# Altium schematic sheet Main_sch.SchDoc: Li-ion Battery Charger
size A4; Engineer: Kavindu Makaranda; Revision: 1.0.0; SheetNumber: 1; SheetTotal: 8
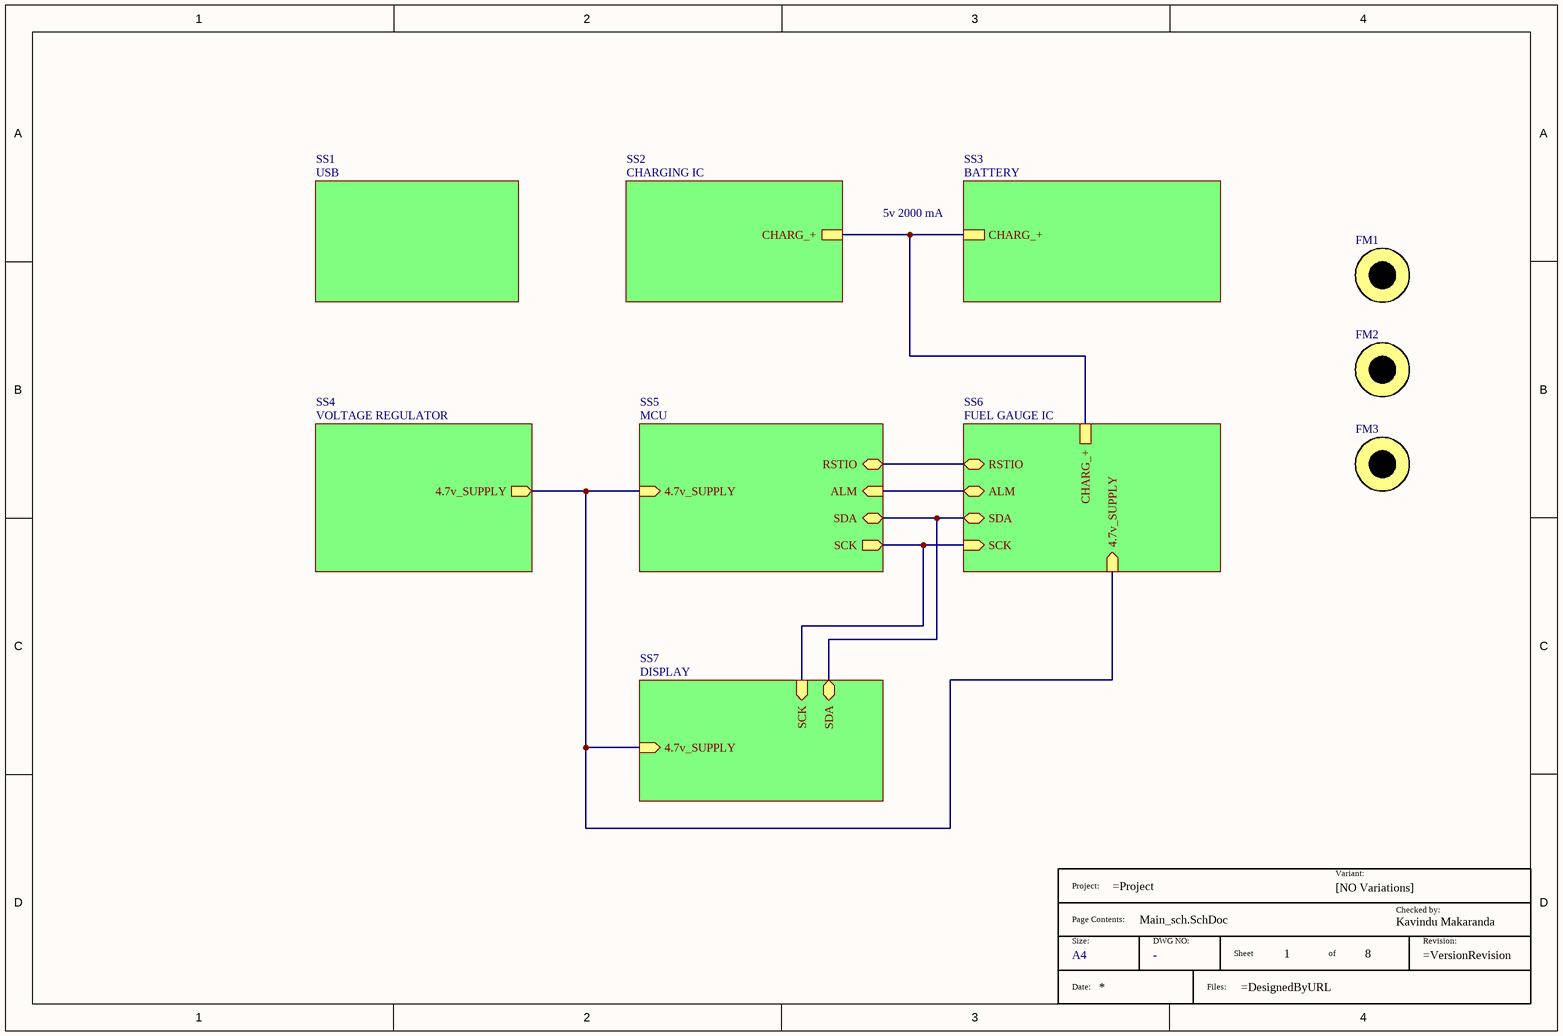
[diagram p0: Main_sch.SchDoc]

## Parts
*  Size: A4  (hidden comment: TitleBlock)  (graphical)
FM1  FIDUCIAL  [FIDUCIAL]  (value not drawn)
FM2  FIDUCIAL  [FIDUCIAL]  (value not drawn)
FM3  FIDUCIAL  [FIDUCIAL]  (value not drawn)

## Sub-sheets
SS1 = USB: no entries
SS2 = CHARGING IC: CHARG_+
SS3 = BATTERY: CHARG_+
SS4 = VOLTAGE REGULATOR: 4.7v_SUPPLY (out)
SS5 = MCU: SCK (out), SDA (bidir), ALM (in), RSTIO (bidir), 4.7v_SUPPLY (in)
SS6 = FUEL GAUGE IC: ALM (bidir), RSTIO (bidir), SDA (bidir), SCK (in), CHARG_+, 4.7v_SUPPLY (in)
SS7 = DISPLAY: 4.7v_SUPPLY (in), SCK (in), SDA (bidir)

## Nets
(unnamed): sheet SS4/4.7v_SUPPLY, sheet SS5/4.7v_SUPPLY, sheet SS6/4.7v_SUPPLY, sheet SS7/4.7v_SUPPLY
(unnamed): sheet SS2/CHARG_+, sheet SS6/CHARG_+, sheet SS3/CHARG_+
(unnamed): sheet SS5/SCK, sheet SS6/SCK, sheet SS7/SCK
(unnamed): sheet SS5/SDA, sheet SS6/SDA, sheet SS7/SDA
(unnamed): sheet SS5/ALM, sheet SS6/ALM
(unnamed): sheet SS5/RSTIO, sheet SS6/RSTIO

## Notes on the sheet
- 5v 2000 mA
- THIS DOCUMENT AND THE DATA DISCLOSED HEREIN OR
- HEREWITH IS THE PROPERTY OF ALTIUM LIMITED AND MAY
- DWG NO:
- REVISION
- REV:
- DESCRIPTION
- DATE
- APPROVED
- BE FREELY DISTRIBUTED IN WHOLE. NO RIGHTS ARE
- RESERVED OR EXPRESS OR IMPLIED WARANTEE GIVEN.
- ENG:
- APPROVALS
- PROJECT
- DSN:
- CHK:
- REFERENCE DOCUMENTS
- PROJECT REVISION:
- TITLE
- DOCUMENT REVISION:
- DESIGN ITEM:
- BOM:
- FAB DWG:
- PCB DWG:
- ASSY DWG:
- SCALE:
- A3
- SIZE
- CAGE CODE
- FILE NAME
- DWG NO.
- SHEET
- OF
- REV
- (in symbol TitleBlock) Project:; Variant:; [NO Variations]; Checked by:; Page Contents:; Kavindu Makaranda; Size:; DWG NO:; Sheet; of; Revision:; Date:; Files:

## Library data of the parts
* = TitleBlock: Standard Title Block; DWG NO: -
FM1-FM3 = FM